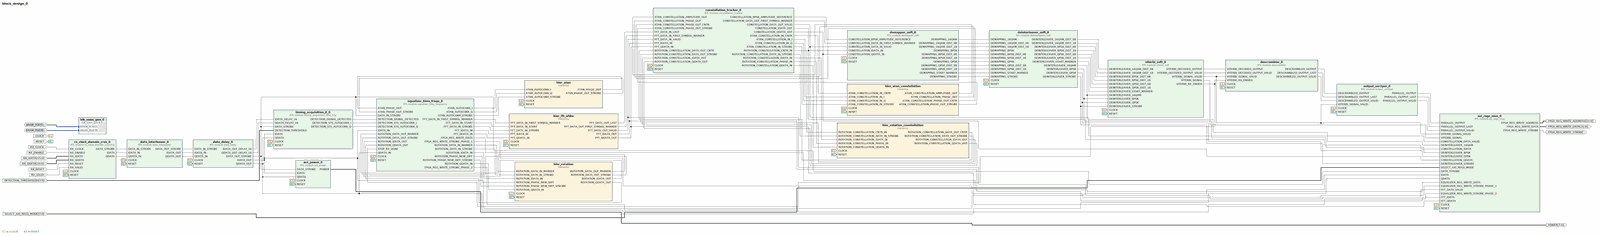
[diagram p0: block diagram of the top level, whole]
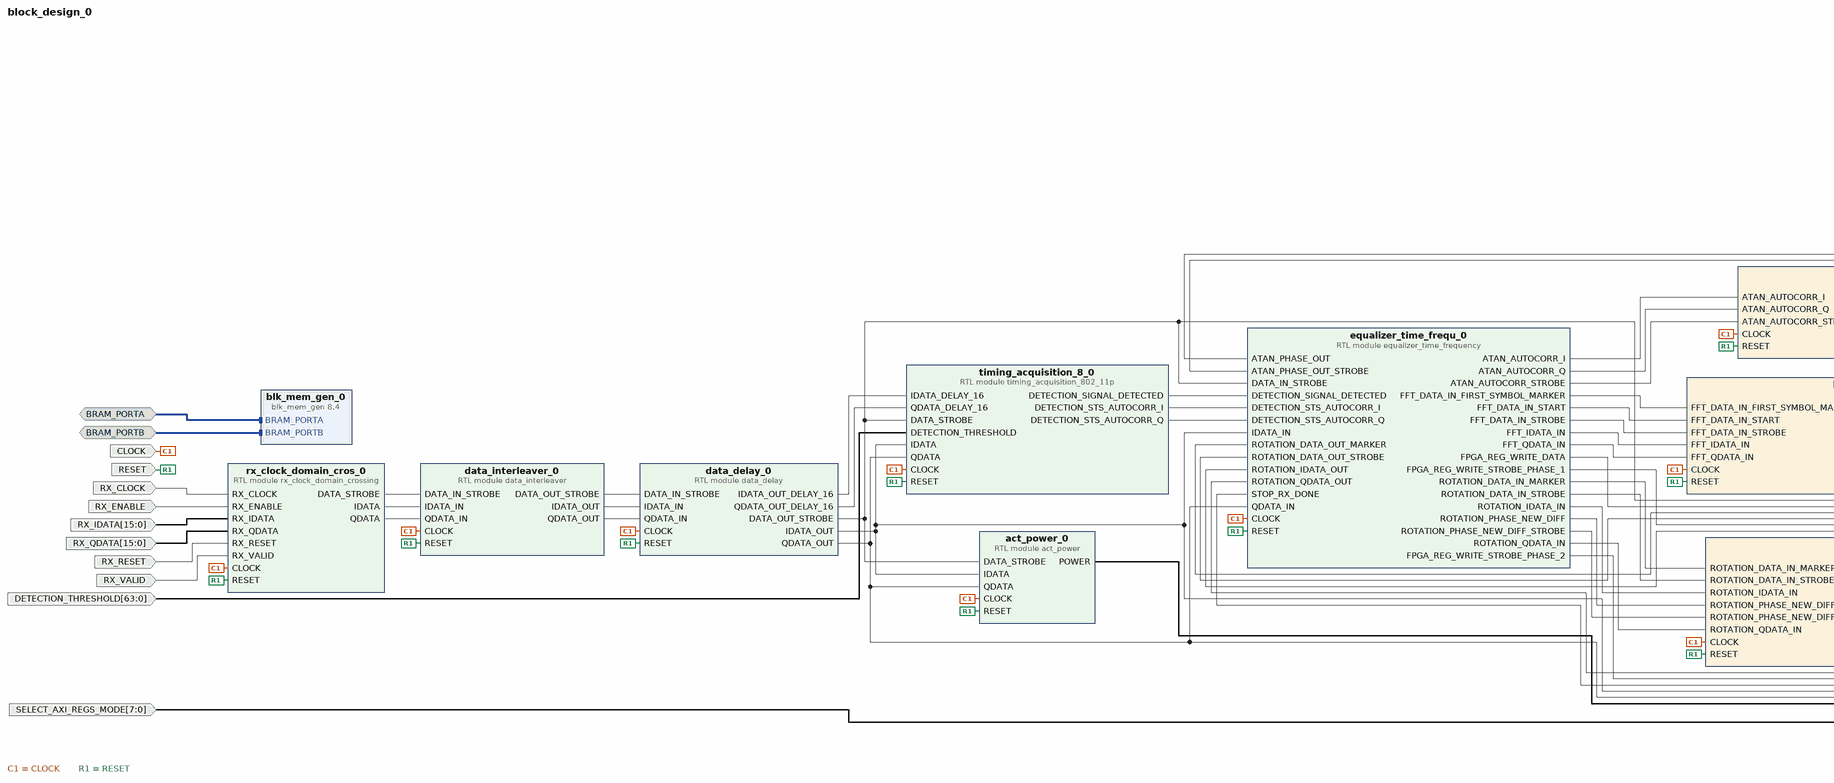
[diagram p1: block diagram of the top level, left part]
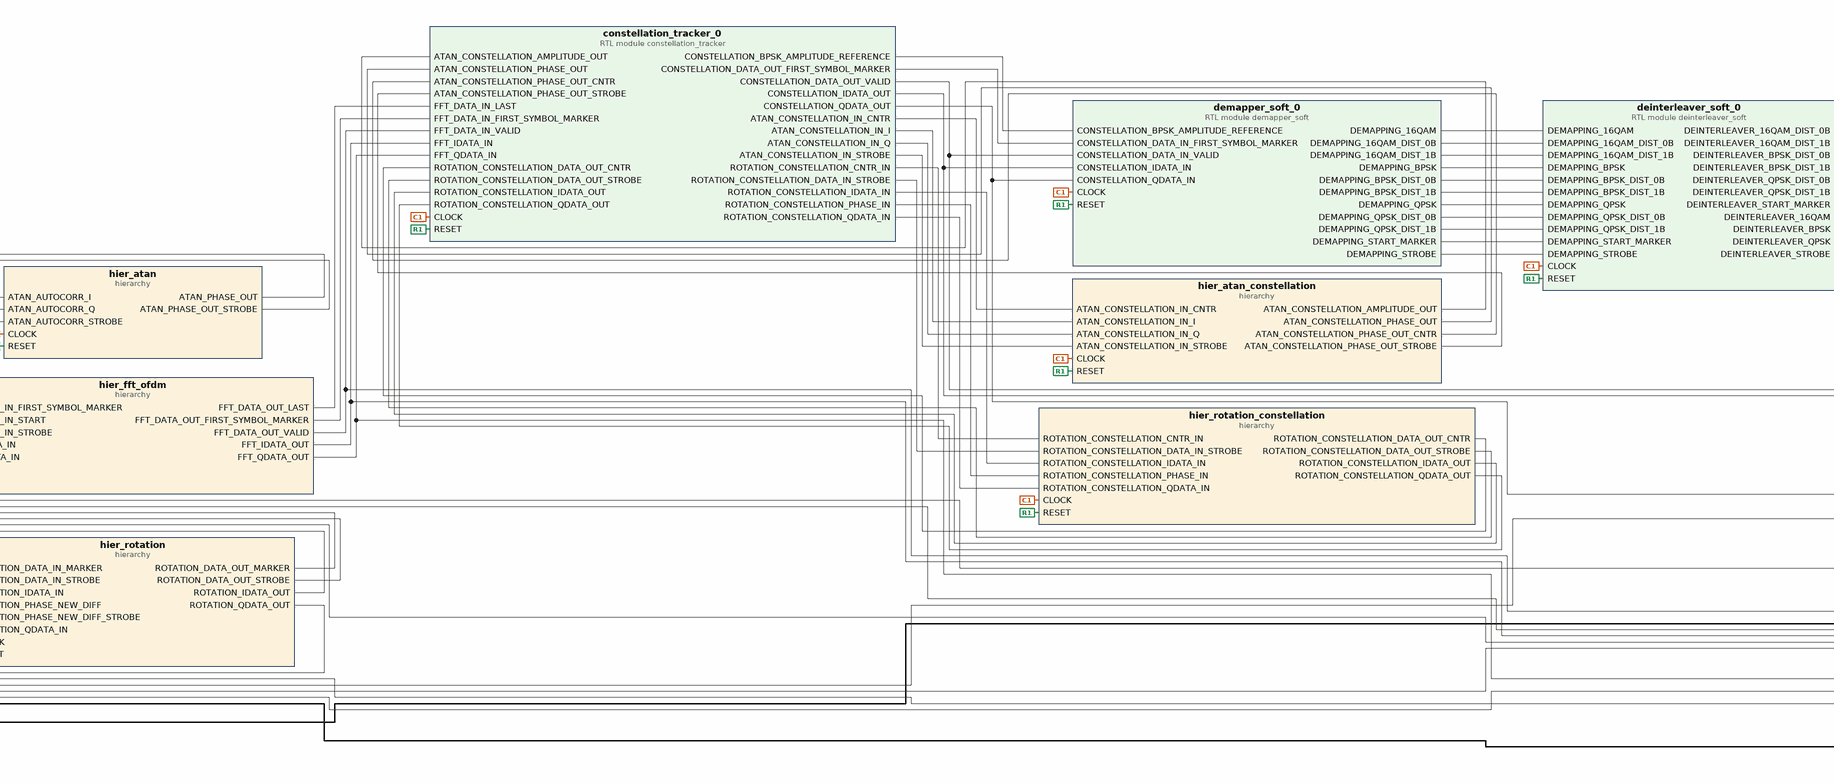
[diagram p2: block diagram of the top level, centre part]
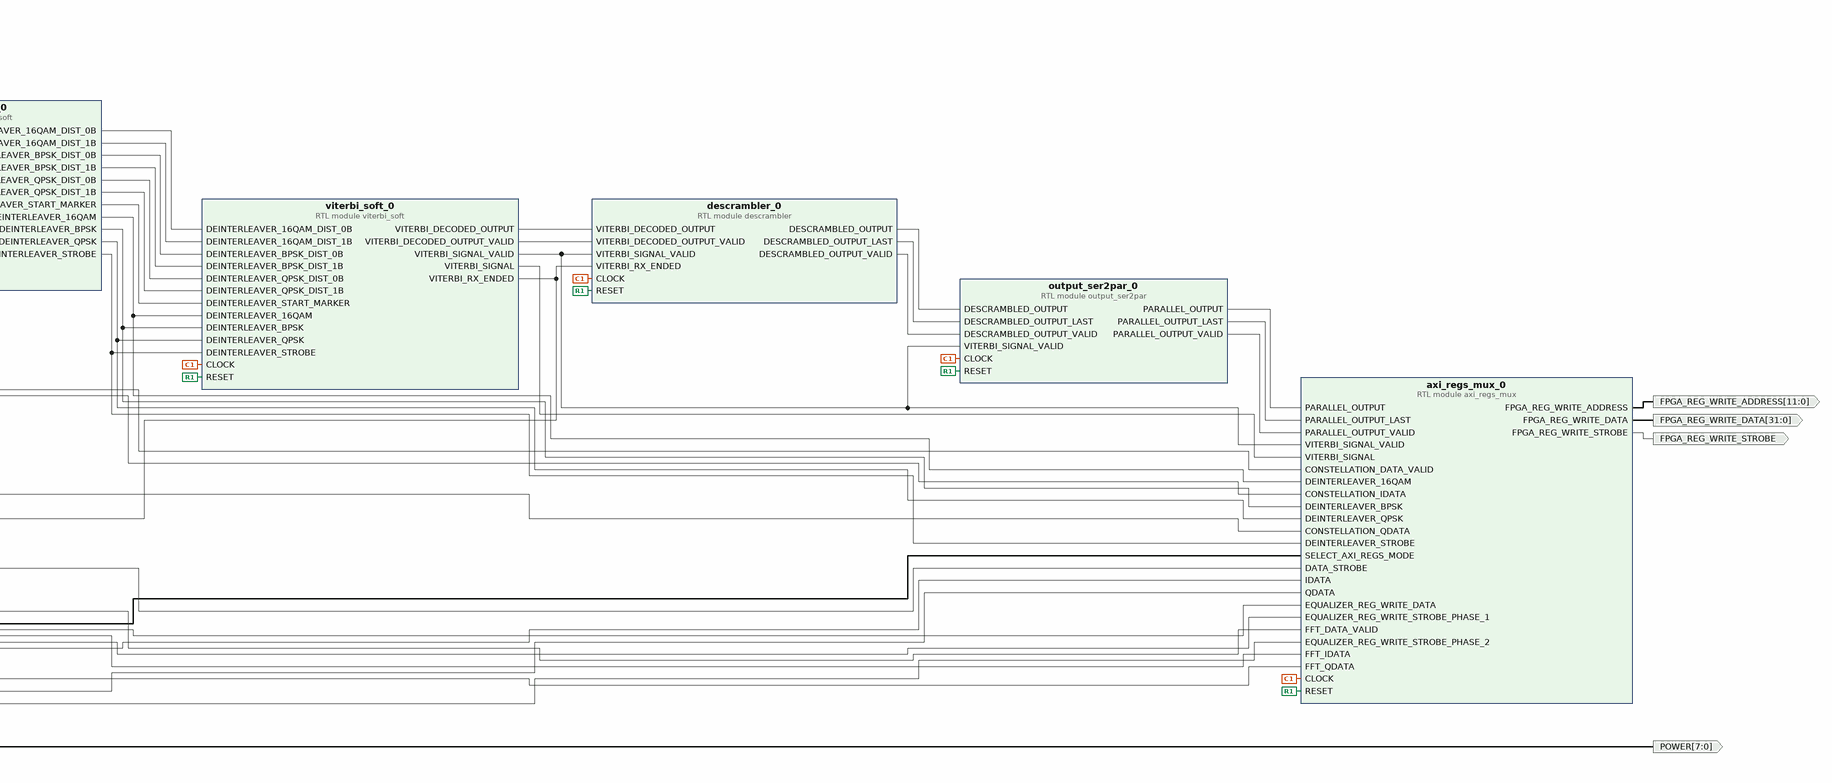
[diagram p3: block diagram of the top level, right part]
# Vivado block design block_design_0, xc7z020clg484-1, Vivado 2023.2.2
create_bd_design block_design_0

create_bd_intf_port -mode Slave -vlnv xilinx.com:interface:bram_rtl:1.0 BRAM_PORTA
create_bd_intf_port -mode Slave -vlnv xilinx.com:interface:bram_rtl:1.0 BRAM_PORTB
create_bd_port -dir I -type rst RESET
create_bd_port -dir I -type clk CLOCK
create_bd_port -dir I RX_VALID
create_bd_port -dir I RX_ENABLE
create_bd_port -dir I -type clk RX_CLOCK
set_property -dict {CONFIG.FREQ_HZ 10000000} [get_bd_ports RX_CLOCK]
create_bd_port -dir I -type rst RX_RESET
create_bd_port -dir I -from 15 -to 0 RX_IDATA
create_bd_port -dir I -from 15 -to 0 RX_QDATA
create_bd_port -dir O -from 7 -to 0 POWER
create_bd_port -dir I -from 63 -to 0 DETECTION_THRESHOLD
create_bd_port -dir O -from 11 -to 0 FPGA_REG_WRITE_ADDRESS
create_bd_port -dir O FPGA_REG_WRITE_STROBE
create_bd_port -dir O -from 31 -to 0 FPGA_REG_WRITE_DATA
create_bd_port -dir I -from 7 -to 0 SELECT_AXI_REGS_MODE

create_bd_cell -type module -reference rx_clock_domain_crossing rx_clock_domain_cros_0
create_bd_cell -type module -reference data_interleaver data_interleaver_0
create_bd_cell -type module -reference data_delay data_delay_0
create_bd_cell -type module -reference act_power act_power_0
create_bd_cell -type module -reference timing_acquisition_802_11p timing_acquisition_8_0
create_bd_cell -type hier hier_fft_ofdm
create_bd_cell -type hier hier_atan
create_bd_cell -type hier hier_rotation
create_bd_cell -type module -reference equalizer_time_frequency equalizer_time_frequ_0
create_bd_cell -type module -reference axi_regs_mux axi_regs_mux_0
create_bd_cell -type hier hier_atan_constellation
create_bd_cell -type hier hier_rotation_constellation
create_bd_cell -type module -reference constellation_tracker constellation_tracker_0
create_bd_cell -type module -reference descrambler descrambler_0
create_bd_cell -type module -reference output_ser2par output_ser2par_0
create_bd_cell -type ip -vlnv xilinx.com:ip:blk_mem_gen:8.4 blk_mem_gen_0
set_property -dict [list \
  CONFIG.Assume_Synchronous_Clk true \
  CONFIG.Collision_Warnings ALL \
  CONFIG.Disable_Collision_Warnings false \
  CONFIG.Fill_Remaining_Memory_Locations true \
  CONFIG.Memory_Type Simple_Dual_Port_RAM \
  CONFIG.Operating_Mode_A READ_FIRST \
  CONFIG.Register_PortB_Output_of_Memory_Primitives false \
  CONFIG.Use_RSTB_Pin false \
  CONFIG.Write_Depth_A 4096 \
  CONFIG.ecctype No_ECC \
  CONFIG.use_bram_block Stand_Alone \
] [get_bd_cells blk_mem_gen_0]
create_bd_cell -type module -reference demapper_soft demapper_soft_0
create_bd_cell -type module -reference deinterleaver_soft deinterleaver_soft_0
create_bd_cell -type module -reference viterbi_soft viterbi_soft_0

# ---- hierarchy /hier_fft_ofdm ----
current_bd_instance /hier_fft_ofdm
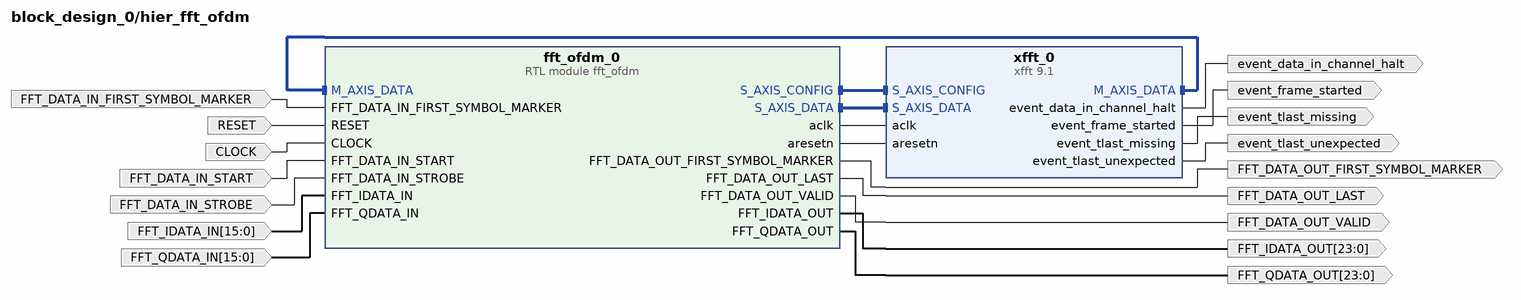
[diagram p4: block diagram inside /hier_fft_ofdm]
create_bd_pin -dir I -type rst RESET
create_bd_pin -dir I -type clk CLOCK
create_bd_pin -dir I -from 15 -to 0 FFT_IDATA_IN
create_bd_pin -dir I -from 15 -to 0 FFT_QDATA_IN
create_bd_pin -dir I FFT_DATA_IN_STROBE
create_bd_pin -dir I FFT_DATA_IN_START
create_bd_pin -dir O -from 23 -to 0 FFT_IDATA_OUT
create_bd_pin -dir O -from 23 -to 0 FFT_QDATA_OUT
create_bd_pin -dir O FFT_DATA_OUT_VALID
create_bd_pin -dir O FFT_DATA_OUT_LAST
create_bd_pin -dir O -type intr event_frame_started
create_bd_pin -dir O -type intr event_tlast_unexpected
create_bd_pin -dir O -type intr event_tlast_missing
create_bd_pin -dir O -type intr event_data_in_channel_halt
create_bd_pin -dir I FFT_DATA_IN_FIRST_SYMBOL_MARKER
create_bd_pin -dir O FFT_DATA_OUT_FIRST_SYMBOL_MARKER

create_bd_cell -type module -reference fft_ofdm fft_ofdm_0
create_bd_cell -type ip -vlnv xilinx.com:ip:xfft:9.1 xfft_0
set_property -dict [list \
  CONFIG.aresetn true \
  CONFIG.implementation_options automatically_select \
  CONFIG.number_of_stages_using_block_ram_for_data_and_phase_factors 0 \
  CONFIG.output_ordering natural_order \
  CONFIG.scaling_options unscaled \
  CONFIG.target_clock_frequency 100 \
  CONFIG.target_data_throughput 10 \
  CONFIG.throttle_scheme realtime \
  CONFIG.transform_length 64 \
] [get_bd_cells xfft_0]

# ---- hierarchy /hier_atan ----
current_bd_instance /hier_atan
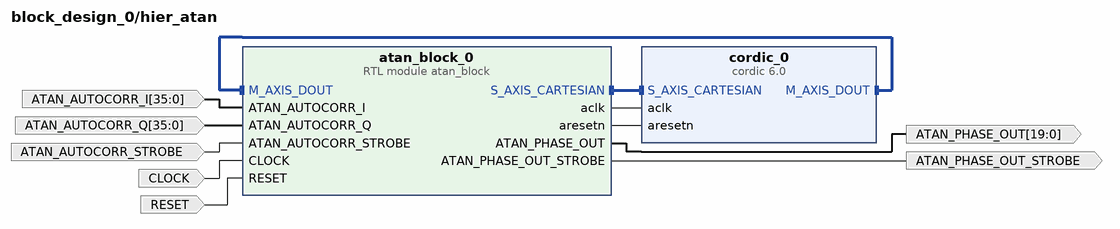
[diagram p5: block diagram inside /hier_atan]
create_bd_pin -dir I -type rst RESET
create_bd_pin -dir I -type clk CLOCK
create_bd_pin -dir I ATAN_AUTOCORR_STROBE
create_bd_pin -dir I -from 35 -to 0 ATAN_AUTOCORR_I
create_bd_pin -dir I -from 35 -to 0 ATAN_AUTOCORR_Q
create_bd_pin -dir O ATAN_PHASE_OUT_STROBE
create_bd_pin -dir O -from 19 -to 0 ATAN_PHASE_OUT

create_bd_cell -type ip -vlnv xilinx.com:ip:cordic:6.0 cordic_0
set_property -dict [list \
  CONFIG.ARESETN true \
  CONFIG.Architectural_Configuration Word_Serial \
  CONFIG.Data_Format SignedFraction \
  CONFIG.Functional_Selection Arc_Tan \
  CONFIG.Input_Width 36 \
  CONFIG.Output_Width 20 \
  CONFIG.Phase_Format Scaled_Radians \
  CONFIG.Pipelining_Mode Optimal \
] [get_bd_cells cordic_0]
create_bd_cell -type module -reference atan_block atan_block_0

# ---- hierarchy /hier_rotation ----
current_bd_instance /hier_rotation
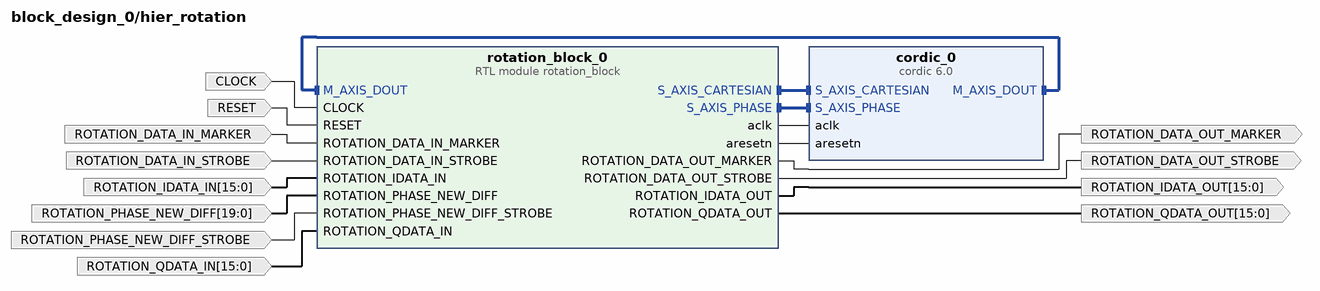
[diagram p6: block diagram inside /hier_rotation]
create_bd_pin -dir I -type rst RESET
create_bd_pin -dir I -type clk CLOCK
create_bd_pin -dir I ROTATION_DATA_IN_STROBE
create_bd_pin -dir I ROTATION_DATA_IN_MARKER
create_bd_pin -dir I -from 15 -to 0 ROTATION_IDATA_IN
create_bd_pin -dir I -from 15 -to 0 ROTATION_QDATA_IN
create_bd_pin -dir I ROTATION_PHASE_NEW_DIFF_STROBE
create_bd_pin -dir I -from 19 -to 0 ROTATION_PHASE_NEW_DIFF
create_bd_pin -dir O ROTATION_DATA_OUT_STROBE
create_bd_pin -dir O ROTATION_DATA_OUT_MARKER
create_bd_pin -dir O -from 15 -to 0 ROTATION_IDATA_OUT
create_bd_pin -dir O -from 15 -to 0 ROTATION_QDATA_OUT

create_bd_cell -type module -reference rotation_block rotation_block_0
create_bd_cell -type ip -vlnv xilinx.com:ip:cordic:6.0 cordic_0
set_property -dict [list \
  CONFIG.ARESETN true \
  CONFIG.Input_Width 16 \
  CONFIG.Output_Width 16 \
  CONFIG.Phase_Format Scaled_Radians \
  CONFIG.cartesian_has_tlast true \
  CONFIG.out_tlast_behv Pass_Cartesian_TLAST \
] [get_bd_cells cordic_0]

# ---- hierarchy /hier_atan_constellation ----
current_bd_instance /hier_atan_constellation
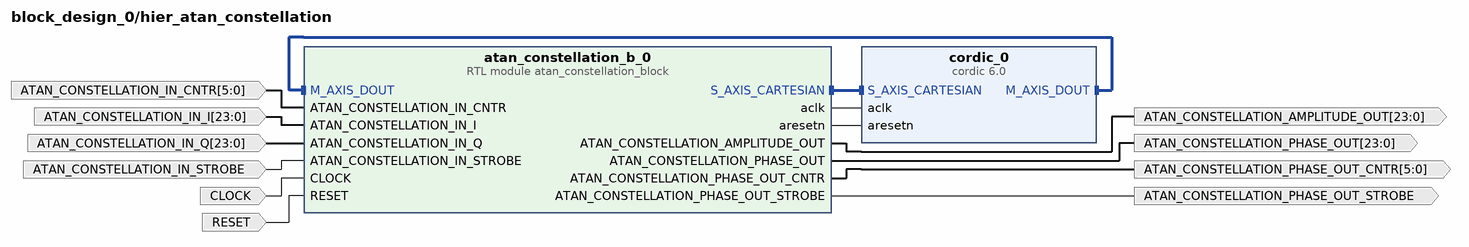
[diagram p7: block diagram inside /hier_atan_constellation]
create_bd_pin -dir I -type rst RESET
create_bd_pin -dir I -type clk CLOCK
create_bd_pin -dir I ATAN_CONSTELLATION_IN_STROBE
create_bd_pin -dir I -from 23 -to 0 ATAN_CONSTELLATION_IN_I
create_bd_pin -dir I -from 23 -to 0 ATAN_CONSTELLATION_IN_Q
create_bd_pin -dir I -from 5 -to 0 ATAN_CONSTELLATION_IN_CNTR
create_bd_pin -dir O ATAN_CONSTELLATION_PHASE_OUT_STROBE
create_bd_pin -dir O -from 23 -to 0 ATAN_CONSTELLATION_PHASE_OUT
create_bd_pin -dir O -from 5 -to 0 ATAN_CONSTELLATION_PHASE_OUT_CNTR
create_bd_pin -dir O -from 23 -to 0 ATAN_CONSTELLATION_AMPLITUDE_OUT

create_bd_cell -type module -reference atan_constellation_block atan_constellation_b_0
create_bd_cell -type ip -vlnv xilinx.com:ip:cordic:6.0 cordic_0
set_property -dict [list \
  CONFIG.ARESETN true \
  CONFIG.Architectural_Configuration Parallel \
  CONFIG.Compensation_Scaling No_Scale_Compensation \
  CONFIG.Data_Format SignedFraction \
  CONFIG.Functional_Selection Translate \
  CONFIG.Input_Width 24 \
  CONFIG.Output_Width 24 \
  CONFIG.Phase_Format Scaled_Radians \
  CONFIG.Pipelining_Mode Maximum \
  CONFIG.cartesian_has_tuser true \
  CONFIG.cartesian_tuser_width 6 \
] [get_bd_cells cordic_0]

# ---- hierarchy /hier_rotation_constellation ----
current_bd_instance /hier_rotation_constellation
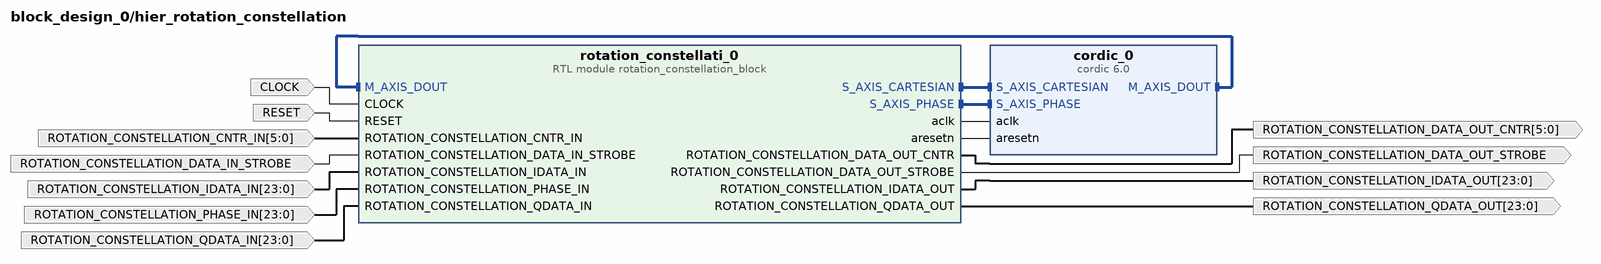
[diagram p8: block diagram inside /hier_rotation_constellation]
create_bd_pin -dir I -type rst RESET
create_bd_pin -dir I -type clk CLOCK
create_bd_pin -dir I ROTATION_CONSTELLATION_DATA_IN_STROBE
create_bd_pin -dir I -from 23 -to 0 ROTATION_CONSTELLATION_IDATA_IN
create_bd_pin -dir I -from 23 -to 0 ROTATION_CONSTELLATION_QDATA_IN
create_bd_pin -dir I -from 23 -to 0 ROTATION_CONSTELLATION_PHASE_IN
create_bd_pin -dir I -from 5 -to 0 ROTATION_CONSTELLATION_CNTR_IN
create_bd_pin -dir O ROTATION_CONSTELLATION_DATA_OUT_STROBE
create_bd_pin -dir O -from 23 -to 0 ROTATION_CONSTELLATION_IDATA_OUT
create_bd_pin -dir O -from 23 -to 0 ROTATION_CONSTELLATION_QDATA_OUT
create_bd_pin -dir O -from 5 -to 0 ROTATION_CONSTELLATION_DATA_OUT_CNTR

create_bd_cell -type ip -vlnv xilinx.com:ip:cordic:6.0 cordic_0
set_property -dict [list \
  CONFIG.ARESETN true \
  CONFIG.Input_Width 24 \
  CONFIG.Output_Width 24 \
  CONFIG.Phase_Format Scaled_Radians \
  CONFIG.cartesian_has_tlast false \
  CONFIG.cartesian_has_tuser true \
  CONFIG.cartesian_tuser_width 6 \
  CONFIG.out_tlast_behv Null \
] [get_bd_cells cordic_0]
create_bd_cell -type module -reference rotation_constellation_block rotation_constellati_0

# ---- connections ----

current_bd_instance /hier_fft_ofdm
connect_bd_intf_net [get_bd_intf_pins xfft_0/S_AXIS_CONFIG] [get_bd_intf_pins fft_ofdm_0/S_AXIS_CONFIG]
connect_bd_intf_net [get_bd_intf_pins fft_ofdm_0/S_AXIS_DATA] [get_bd_intf_pins xfft_0/S_AXIS_DATA]
connect_bd_intf_net [get_bd_intf_pins xfft_0/M_AXIS_DATA] [get_bd_intf_pins fft_ofdm_0/M_AXIS_DATA]
connect_bd_net [get_bd_pins FFT_DATA_IN_FIRST_SYMBOL_MARKER] [get_bd_pins fft_ofdm_0/FFT_DATA_IN_FIRST_SYMBOL_MARKER]
connect_bd_net [get_bd_pins RESET] [get_bd_pins fft_ofdm_0/RESET]
connect_bd_net [get_bd_pins CLOCK] [get_bd_pins fft_ofdm_0/CLOCK]
connect_bd_net [get_bd_pins fft_ofdm_0/FFT_DATA_OUT_FIRST_SYMBOL_MARKER] [get_bd_pins FFT_DATA_OUT_FIRST_SYMBOL_MARKER]
connect_bd_net [get_bd_pins fft_ofdm_0/FFT_DATA_OUT_LAST] [get_bd_pins FFT_DATA_OUT_LAST]
connect_bd_net [get_bd_pins fft_ofdm_0/FFT_DATA_OUT_VALID] [get_bd_pins FFT_DATA_OUT_VALID]
connect_bd_net [get_bd_pins fft_ofdm_0/FFT_IDATA_OUT] [get_bd_pins FFT_IDATA_OUT]
connect_bd_net [get_bd_pins fft_ofdm_0/FFT_QDATA_OUT] [get_bd_pins FFT_QDATA_OUT]
connect_bd_net [get_bd_pins fft_ofdm_0/aclk] [get_bd_pins xfft_0/aclk]
connect_bd_net [get_bd_pins fft_ofdm_0/aresetn] [get_bd_pins xfft_0/aresetn]
connect_bd_net -net receiver_802_11p_0_FFT_DATA_IN_START [get_bd_pins FFT_DATA_IN_START] [get_bd_pins fft_ofdm_0/FFT_DATA_IN_START]
connect_bd_net -net receiver_802_11p_0_FFT_DATA_IN_STROBE [get_bd_pins FFT_DATA_IN_STROBE] [get_bd_pins fft_ofdm_0/FFT_DATA_IN_STROBE]
connect_bd_net -net receiver_802_11p_0_FFT_IDATA_IN [get_bd_pins FFT_IDATA_IN] [get_bd_pins fft_ofdm_0/FFT_IDATA_IN]
connect_bd_net -net receiver_802_11p_0_FFT_QDATA_IN [get_bd_pins FFT_QDATA_IN] [get_bd_pins fft_ofdm_0/FFT_QDATA_IN]
connect_bd_net [get_bd_pins xfft_0/event_data_in_channel_halt] [get_bd_pins event_data_in_channel_halt]
connect_bd_net [get_bd_pins xfft_0/event_frame_started] [get_bd_pins event_frame_started]
connect_bd_net [get_bd_pins xfft_0/event_tlast_missing] [get_bd_pins event_tlast_missing]
connect_bd_net [get_bd_pins xfft_0/event_tlast_unexpected] [get_bd_pins event_tlast_unexpected]

current_bd_instance /hier_atan
connect_bd_intf_net [get_bd_intf_pins cordic_0/S_AXIS_CARTESIAN] [get_bd_intf_pins atan_block_0/S_AXIS_CARTESIAN]
connect_bd_intf_net [get_bd_intf_pins cordic_0/M_AXIS_DOUT] [get_bd_intf_pins atan_block_0/M_AXIS_DOUT]
connect_bd_net [get_bd_pins ATAN_AUTOCORR_I] [get_bd_pins atan_block_0/ATAN_AUTOCORR_I]
connect_bd_net [get_bd_pins ATAN_AUTOCORR_Q] [get_bd_pins atan_block_0/ATAN_AUTOCORR_Q]
connect_bd_net [get_bd_pins ATAN_AUTOCORR_STROBE] [get_bd_pins atan_block_0/ATAN_AUTOCORR_STROBE]
connect_bd_net [get_bd_pins CLOCK] [get_bd_pins atan_block_0/CLOCK]
connect_bd_net [get_bd_pins RESET] [get_bd_pins atan_block_0/RESET]
connect_bd_net [get_bd_pins atan_block_0/ATAN_PHASE_OUT] [get_bd_pins ATAN_PHASE_OUT]
connect_bd_net [get_bd_pins atan_block_0/ATAN_PHASE_OUT_STROBE] [get_bd_pins ATAN_PHASE_OUT_STROBE]
connect_bd_net [get_bd_pins atan_block_0/aclk] [get_bd_pins cordic_0/aclk]
connect_bd_net [get_bd_pins atan_block_0/aresetn] [get_bd_pins cordic_0/aresetn]

current_bd_instance /hier_rotation
connect_bd_intf_net [get_bd_intf_pins cordic_0/M_AXIS_DOUT] [get_bd_intf_pins rotation_block_0/M_AXIS_DOUT]
connect_bd_intf_net [get_bd_intf_pins cordic_0/S_AXIS_CARTESIAN] [get_bd_intf_pins rotation_block_0/S_AXIS_CARTESIAN]
connect_bd_intf_net [get_bd_intf_pins cordic_0/S_AXIS_PHASE] [get_bd_intf_pins rotation_block_0/S_AXIS_PHASE]
connect_bd_net -net CLOCK_0_1 [get_bd_pins CLOCK] [get_bd_pins rotation_block_0/CLOCK]
connect_bd_net -net RESET_0_1 [get_bd_pins RESET] [get_bd_pins rotation_block_0/RESET]
connect_bd_net -net receiver_802_11p_0_ROTATION_DATA_IN_MARKER [get_bd_pins ROTATION_DATA_IN_MARKER] \
  [get_bd_pins rotation_block_0/ROTATION_DATA_IN_MARKER]
connect_bd_net -net receiver_802_11p_0_ROTATION_DATA_IN_STROBE [get_bd_pins ROTATION_DATA_IN_STROBE] \
  [get_bd_pins rotation_block_0/ROTATION_DATA_IN_STROBE]
connect_bd_net -net receiver_802_11p_0_ROTATION_IDATA_IN [get_bd_pins ROTATION_IDATA_IN] [get_bd_pins rotation_block_0/ROTATION_IDATA_IN]
connect_bd_net -net receiver_802_11p_0_ROTATION_PHASE_NEW_DIFF [get_bd_pins ROTATION_PHASE_NEW_DIFF] \
  [get_bd_pins rotation_block_0/ROTATION_PHASE_NEW_DIFF]
connect_bd_net -net receiver_802_11p_0_ROTATION_PHASE_NEW_DIFF_STROBE [get_bd_pins ROTATION_PHASE_NEW_DIFF_STROBE] \
  [get_bd_pins rotation_block_0/ROTATION_PHASE_NEW_DIFF_STROBE]
connect_bd_net -net receiver_802_11p_0_ROTATION_QDATA_IN [get_bd_pins ROTATION_QDATA_IN] [get_bd_pins rotation_block_0/ROTATION_QDATA_IN]
connect_bd_net [get_bd_pins rotation_block_0/ROTATION_DATA_OUT_MARKER] [get_bd_pins ROTATION_DATA_OUT_MARKER]
connect_bd_net [get_bd_pins rotation_block_0/ROTATION_DATA_OUT_STROBE] [get_bd_pins ROTATION_DATA_OUT_STROBE]
connect_bd_net [get_bd_pins rotation_block_0/ROTATION_IDATA_OUT] [get_bd_pins ROTATION_IDATA_OUT]
connect_bd_net [get_bd_pins rotation_block_0/ROTATION_QDATA_OUT] [get_bd_pins ROTATION_QDATA_OUT]
connect_bd_net [get_bd_pins rotation_block_0/aclk] [get_bd_pins cordic_0/aclk]
connect_bd_net [get_bd_pins rotation_block_0/aresetn] [get_bd_pins cordic_0/aresetn]

current_bd_instance /hier_atan_constellation
connect_bd_intf_net [get_bd_intf_pins atan_constellation_b_0/S_AXIS_CARTESIAN] [get_bd_intf_pins cordic_0/S_AXIS_CARTESIAN]
connect_bd_intf_net [get_bd_intf_pins cordic_0/M_AXIS_DOUT] [get_bd_intf_pins atan_constellation_b_0/M_AXIS_DOUT]
connect_bd_net [get_bd_pins ATAN_CONSTELLATION_IN_CNTR] [get_bd_pins atan_constellation_b_0/ATAN_CONSTELLATION_IN_CNTR]
connect_bd_net [get_bd_pins ATAN_CONSTELLATION_IN_I] [get_bd_pins atan_constellation_b_0/ATAN_CONSTELLATION_IN_I]
connect_bd_net [get_bd_pins ATAN_CONSTELLATION_IN_Q] [get_bd_pins atan_constellation_b_0/ATAN_CONSTELLATION_IN_Q]
connect_bd_net [get_bd_pins ATAN_CONSTELLATION_IN_STROBE] [get_bd_pins atan_constellation_b_0/ATAN_CONSTELLATION_IN_STROBE]
connect_bd_net -net CLOCK_0_1 [get_bd_pins CLOCK] [get_bd_pins atan_constellation_b_0/CLOCK]
connect_bd_net -net RESET_0_1 [get_bd_pins RESET] [get_bd_pins atan_constellation_b_0/RESET]
connect_bd_net [get_bd_pins atan_constellation_b_0/ATAN_CONSTELLATION_AMPLITUDE_OUT] [get_bd_pins ATAN_CONSTELLATION_AMPLITUDE_OUT]
connect_bd_net [get_bd_pins atan_constellation_b_0/ATAN_CONSTELLATION_PHASE_OUT] [get_bd_pins ATAN_CONSTELLATION_PHASE_OUT]
connect_bd_net [get_bd_pins atan_constellation_b_0/ATAN_CONSTELLATION_PHASE_OUT_CNTR] [get_bd_pins ATAN_CONSTELLATION_PHASE_OUT_CNTR]
connect_bd_net [get_bd_pins atan_constellation_b_0/ATAN_CONSTELLATION_PHASE_OUT_STROBE] [get_bd_pins ATAN_CONSTELLATION_PHASE_OUT_STROBE]
connect_bd_net [get_bd_pins atan_constellation_b_0/aclk] [get_bd_pins cordic_0/aclk]
connect_bd_net [get_bd_pins atan_constellation_b_0/aresetn] [get_bd_pins cordic_0/aresetn]

current_bd_instance /hier_rotation_constellation
connect_bd_intf_net [get_bd_intf_pins rotation_constellati_0/M_AXIS_DOUT] [get_bd_intf_pins cordic_0/M_AXIS_DOUT]
connect_bd_intf_net [get_bd_intf_pins rotation_constellati_0/S_AXIS_CARTESIAN] [get_bd_intf_pins cordic_0/S_AXIS_CARTESIAN]
connect_bd_intf_net [get_bd_intf_pins cordic_0/S_AXIS_PHASE] [get_bd_intf_pins rotation_constellati_0/S_AXIS_PHASE]
connect_bd_net -net CLOCK_0_1 [get_bd_pins CLOCK] [get_bd_pins rotation_constellati_0/CLOCK]
connect_bd_net -net RESET_0_1 [get_bd_pins RESET] [get_bd_pins rotation_constellati_0/RESET]
connect_bd_net [get_bd_pins ROTATION_CONSTELLATION_CNTR_IN] [get_bd_pins rotation_constellati_0/ROTATION_CONSTELLATION_CNTR_IN]
connect_bd_net [get_bd_pins ROTATION_CONSTELLATION_DATA_IN_STROBE] [get_bd_pins rotation_constellati_0/ROTATION_CONSTELLATION_DATA_IN_STROBE]
connect_bd_net [get_bd_pins ROTATION_CONSTELLATION_IDATA_IN] [get_bd_pins rotation_constellati_0/ROTATION_CONSTELLATION_IDATA_IN]
connect_bd_net [get_bd_pins ROTATION_CONSTELLATION_PHASE_IN] [get_bd_pins rotation_constellati_0/ROTATION_CONSTELLATION_PHASE_IN]
connect_bd_net [get_bd_pins ROTATION_CONSTELLATION_QDATA_IN] [get_bd_pins rotation_constellati_0/ROTATION_CONSTELLATION_QDATA_IN]
connect_bd_net [get_bd_pins rotation_constellati_0/ROTATION_CONSTELLATION_DATA_OUT_CNTR] [get_bd_pins ROTATION_CONSTELLATION_DATA_OUT_CNTR]
connect_bd_net [get_bd_pins rotation_constellati_0/ROTATION_CONSTELLATION_DATA_OUT_STROBE] [get_bd_pins ROTATION_CONSTELLATION_DATA_OUT_STROBE]
connect_bd_net [get_bd_pins rotation_constellati_0/ROTATION_CONSTELLATION_IDATA_OUT] [get_bd_pins ROTATION_CONSTELLATION_IDATA_OUT]
connect_bd_net [get_bd_pins rotation_constellati_0/ROTATION_CONSTELLATION_QDATA_OUT] [get_bd_pins ROTATION_CONSTELLATION_QDATA_OUT]
connect_bd_net [get_bd_pins rotation_constellati_0/aclk] [get_bd_pins cordic_0/aclk]
connect_bd_net [get_bd_pins rotation_constellati_0/aresetn] [get_bd_pins cordic_0/aresetn]

current_bd_instance /
connect_bd_intf_net -intf_net BRAM_PORTA_0_1 [get_bd_intf_ports BRAM_PORTA] [get_bd_intf_pins blk_mem_gen_0/BRAM_PORTA]
connect_bd_intf_net -intf_net BRAM_PORTB_0_1 [get_bd_intf_ports BRAM_PORTB] [get_bd_intf_pins blk_mem_gen_0/BRAM_PORTB]
connect_bd_net -net CLOCK_0_1 [get_bd_ports CLOCK] \
  [get_bd_pins hier_fft_ofdm/CLOCK] [get_bd_pins hier_atan/CLOCK] [get_bd_pins hier_rotation/CLOCK] \
  [get_bd_pins hier_atan_constellation/CLOCK] [get_bd_pins hier_rotation_constellation/CLOCK] [get_bd_pins act_power_0/CLOCK] \
  [get_bd_pins data_interleaver_0/CLOCK] [get_bd_pins axi_regs_mux_0/CLOCK] [get_bd_pins output_ser2par_0/CLOCK] \
  [get_bd_pins rx_clock_domain_cros_0/CLOCK] [get_bd_pins deinterleaver_soft_0/CLOCK] [get_bd_pins demapper_soft_0/CLOCK] \
  [get_bd_pins constellation_tracker_0/CLOCK] [get_bd_pins data_delay_0/CLOCK] [get_bd_pins descrambler_0/CLOCK] \
  [get_bd_pins viterbi_soft_0/CLOCK] [get_bd_pins equalizer_time_frequ_0/CLOCK] [get_bd_pins timing_acquisition_8_0/CLOCK]
connect_bd_net -net DETECTION_THRESHOLD_0_1 [get_bd_ports DETECTION_THRESHOLD] [get_bd_pins timing_acquisition_8_0/DETECTION_THRESHOLD]
connect_bd_net -net RESET_0_1 [get_bd_ports RESET] \
  [get_bd_pins hier_fft_ofdm/RESET] [get_bd_pins hier_atan/RESET] [get_bd_pins hier_rotation/RESET] \
  [get_bd_pins hier_atan_constellation/RESET] [get_bd_pins hier_rotation_constellation/RESET] [get_bd_pins act_power_0/RESET] \
  [get_bd_pins data_interleaver_0/RESET] [get_bd_pins axi_regs_mux_0/RESET] [get_bd_pins output_ser2par_0/RESET] \
  [get_bd_pins rx_clock_domain_cros_0/RESET] [get_bd_pins deinterleaver_soft_0/RESET] [get_bd_pins demapper_soft_0/RESET] \
  [get_bd_pins constellation_tracker_0/RESET] [get_bd_pins data_delay_0/RESET] [get_bd_pins descrambler_0/RESET] \
  [get_bd_pins viterbi_soft_0/RESET] [get_bd_pins equalizer_time_frequ_0/RESET] [get_bd_pins timing_acquisition_8_0/RESET]
connect_bd_net -net RX_CLOCK_0_1 [get_bd_ports RX_CLOCK] [get_bd_pins rx_clock_domain_cros_0/RX_CLOCK]
connect_bd_net -net RX_ENABLE_0_1 [get_bd_ports RX_ENABLE] [get_bd_pins rx_clock_domain_cros_0/RX_ENABLE]
connect_bd_net -net RX_IDATA_0_1 [get_bd_ports RX_IDATA] [get_bd_pins rx_clock_domain_cros_0/RX_IDATA]
connect_bd_net -net RX_QDATA_0_1 [get_bd_ports RX_QDATA] [get_bd_pins rx_clock_domain_cros_0/RX_QDATA]
connect_bd_net -net RX_RESET_0_1 [get_bd_ports RX_RESET] [get_bd_pins rx_clock_domain_cros_0/RX_RESET]
connect_bd_net -net RX_VALID_0_1 [get_bd_ports RX_VALID] [get_bd_pins rx_clock_domain_cros_0/RX_VALID]
connect_bd_net -net SELECT_AXI_REGS_MODE_0_1 [get_bd_ports SELECT_AXI_REGS_MODE] [get_bd_pins axi_regs_mux_0/SELECT_AXI_REGS_MODE]
connect_bd_net [get_bd_pins act_power_0/POWER] [get_bd_ports POWER]
connect_bd_net [get_bd_pins axi_regs_mux_0/FPGA_REG_WRITE_DATA] [get_bd_ports FPGA_REG_WRITE_DATA]
connect_bd_net [get_bd_pins axi_regs_mux_0/FPGA_REG_WRITE_STROBE] [get_bd_ports FPGA_REG_WRITE_STROBE]
connect_bd_net [get_bd_pins constellation_tracker_0/ATAN_CONSTELLATION_IN_CNTR] [get_bd_pins hier_atan_constellation/ATAN_CONSTELLATION_IN_CNTR]
connect_bd_net [get_bd_pins constellation_tracker_0/ATAN_CONSTELLATION_IN_I] [get_bd_pins hier_atan_constellation/ATAN_CONSTELLATION_IN_I]
connect_bd_net [get_bd_pins constellation_tracker_0/ATAN_CONSTELLATION_IN_Q] [get_bd_pins hier_atan_constellation/ATAN_CONSTELLATION_IN_Q]
connect_bd_net [get_bd_pins constellation_tracker_0/ATAN_CONSTELLATION_IN_STROBE] [get_bd_pins hier_atan_constellation/ATAN_CONSTELLATION_IN_STROBE]
connect_bd_net [get_bd_pins constellation_tracker_0/CONSTELLATION_BPSK_AMPLITUDE_REFERENCE] \
  [get_bd_pins demapper_soft_0/CONSTELLATION_BPSK_AMPLITUDE_REFERENCE]
connect_bd_net [get_bd_pins constellation_tracker_0/CONSTELLATION_DATA_OUT_FIRST_SYMBOL_MARKER] \
  [get_bd_pins demapper_soft_0/CONSTELLATION_DATA_IN_FIRST_SYMBOL_MARKER]
connect_bd_net [get_bd_pins constellation_tracker_0/CONSTELLATION_DATA_OUT_VALID] \
  [get_bd_pins axi_regs_mux_0/CONSTELLATION_DATA_VALID] [get_bd_pins demapper_soft_0/CONSTELLATION_DATA_IN_VALID]
connect_bd_net [get_bd_pins constellation_tracker_0/CONSTELLATION_IDATA_OUT] \
  [get_bd_pins axi_regs_mux_0/CONSTELLATION_IDATA] [get_bd_pins demapper_soft_0/CONSTELLATION_IDATA_IN]
connect_bd_net [get_bd_pins constellation_tracker_0/CONSTELLATION_QDATA_OUT] \
  [get_bd_pins axi_regs_mux_0/CONSTELLATION_QDATA] [get_bd_pins demapper_soft_0/CONSTELLATION_QDATA_IN]
connect_bd_net [get_bd_pins constellation_tracker_0/ROTATION_CONSTELLATION_CNTR_IN] \
  [get_bd_pins hier_rotation_constellation/ROTATION_CONSTELLATION_CNTR_IN]
connect_bd_net [get_bd_pins constellation_tracker_0/ROTATION_CONSTELLATION_DATA_IN_STROBE] \
  [get_bd_pins hier_rotation_constellation/ROTATION_CONSTELLATION_DATA_IN_STROBE]
connect_bd_net [get_bd_pins constellation_tracker_0/ROTATION_CONSTELLATION_IDATA_IN] \
  [get_bd_pins hier_rotation_constellation/ROTATION_CONSTELLATION_IDATA_IN]
connect_bd_net [get_bd_pins constellation_tracker_0/ROTATION_CONSTELLATION_PHASE_IN] \
  [get_bd_pins hier_rotation_constellation/ROTATION_CONSTELLATION_PHASE_IN]
connect_bd_net [get_bd_pins constellation_tracker_0/ROTATION_CONSTELLATION_QDATA_IN] \
  [get_bd_pins hier_rotation_constellation/ROTATION_CONSTELLATION_QDATA_IN]
connect_bd_net [get_bd_pins data_delay_0/DATA_OUT_STROBE] \
  [get_bd_pins act_power_0/DATA_STROBE] [get_bd_pins axi_regs_mux_0/DATA_STROBE] \
  [get_bd_pins equalizer_time_frequ_0/DATA_IN_STROBE] [get_bd_pins timing_acquisition_8_0/DATA_STROBE]
connect_bd_net [get_bd_pins data_delay_0/IDATA_OUT] \
  [get_bd_pins act_power_0/IDATA] [get_bd_pins axi_regs_mux_0/IDATA] [get_bd_pins equalizer_time_frequ_0/IDATA_IN] \
  [get_bd_pins timing_acquisition_8_0/IDATA]
connect_bd_net [get_bd_pins data_delay_0/IDATA_OUT_DELAY_16] [get_bd_pins timing_acquisition_8_0/IDATA_DELAY_16]
connect_bd_net [get_bd_pins data_delay_0/QDATA_OUT] \
  [get_bd_pins act_power_0/QDATA] [get_bd_pins axi_regs_mux_0/QDATA] [get_bd_pins equalizer_time_frequ_0/QDATA_IN] \
  [get_bd_pins timing_acquisition_8_0/QDATA]
connect_bd_net [get_bd_pins data_delay_0/QDATA_OUT_DELAY_16] [get_bd_pins timing_acquisition_8_0/QDATA_DELAY_16]
connect_bd_net [get_bd_pins data_interleaver_0/DATA_OUT_STROBE] [get_bd_pins data_delay_0/DATA_IN_STROBE]
connect_bd_net [get_bd_pins data_interleaver_0/IDATA_OUT] [get_bd_pins data_delay_0/IDATA_IN]
connect_bd_net [get_bd_pins data_interleaver_0/QDATA_OUT] [get_bd_pins data_delay_0/QDATA_IN]
connect_bd_net [get_bd_pins deinterleaver_soft_0/DEINTERLEAVER_16QAM] \
  [get_bd_pins axi_regs_mux_0/DEINTERLEAVER_16QAM] [get_bd_pins viterbi_soft_0/DEINTERLEAVER_16QAM]
connect_bd_net [get_bd_pins deinterleaver_soft_0/DEINTERLEAVER_16QAM_DIST_0B] [get_bd_pins viterbi_soft_0/DEINTERLEAVER_16QAM_DIST_0B]
connect_bd_net [get_bd_pins deinterleaver_soft_0/DEINTERLEAVER_16QAM_DIST_1B] [get_bd_pins viterbi_soft_0/DEINTERLEAVER_16QAM_DIST_1B]
connect_bd_net [get_bd_pins deinterleaver_soft_0/DEINTERLEAVER_BPSK] \
  [get_bd_pins axi_regs_mux_0/DEINTERLEAVER_BPSK] [get_bd_pins viterbi_soft_0/DEINTERLEAVER_BPSK]
connect_bd_net [get_bd_pins deinterleaver_soft_0/DEINTERLEAVER_BPSK_DIST_0B] [get_bd_pins viterbi_soft_0/DEINTERLEAVER_BPSK_DIST_0B]
connect_bd_net [get_bd_pins deinterleaver_soft_0/DEINTERLEAVER_BPSK_DIST_1B] [get_bd_pins viterbi_soft_0/DEINTERLEAVER_BPSK_DIST_1B]
connect_bd_net [get_bd_pins deinterleaver_soft_0/DEINTERLEAVER_QPSK] \
  [get_bd_pins axi_regs_mux_0/DEINTERLEAVER_QPSK] [get_bd_pins viterbi_soft_0/DEINTERLEAVER_QPSK]
connect_bd_net [get_bd_pins deinterleaver_soft_0/DEINTERLEAVER_QPSK_DIST_0B] [get_bd_pins viterbi_soft_0/DEINTERLEAVER_QPSK_DIST_0B]
connect_bd_net [get_bd_pins deinterleaver_soft_0/DEINTERLEAVER_QPSK_DIST_1B] [get_bd_pins viterbi_soft_0/DEINTERLEAVER_QPSK_DIST_1B]
connect_bd_net [get_bd_pins deinterleaver_soft_0/DEINTERLEAVER_START_MARKER] [get_bd_pins viterbi_soft_0/DEINTERLEAVER_START_MARKER]
connect_bd_net [get_bd_pins deinterleaver_soft_0/DEINTERLEAVER_STROBE] \
  [get_bd_pins axi_regs_mux_0/DEINTERLEAVER_STROBE] [get_bd_pins viterbi_soft_0/DEINTERLEAVER_STROBE]
connect_bd_net [get_bd_pins demapper_soft_0/DEMAPPING_16QAM] [get_bd_pins deinterleaver_soft_0/DEMAPPING_16QAM]
connect_bd_net [get_bd_pins demapper_soft_0/DEMAPPING_16QAM_DIST_0B] [get_bd_pins deinterleaver_soft_0/DEMAPPING_16QAM_DIST_0B]
connect_bd_net [get_bd_pins demapper_soft_0/DEMAPPING_16QAM_DIST_1B] [get_bd_pins deinterleaver_soft_0/DEMAPPING_16QAM_DIST_1B]
connect_bd_net [get_bd_pins demapper_soft_0/DEMAPPING_BPSK] [get_bd_pins deinterleaver_soft_0/DEMAPPING_BPSK]
connect_bd_net [get_bd_pins demapper_soft_0/DEMAPPING_BPSK_DIST_0B] [get_bd_pins deinterleaver_soft_0/DEMAPPING_BPSK_DIST_0B]
connect_bd_net [get_bd_pins demapper_soft_0/DEMAPPING_BPSK_DIST_1B] [get_bd_pins deinterleaver_soft_0/DEMAPPING_BPSK_DIST_1B]
connect_bd_net [get_bd_pins demapper_soft_0/DEMAPPING_QPSK] [get_bd_pins deinterleaver_soft_0/DEMAPPING_QPSK]
connect_bd_net [get_bd_pins demapper_soft_0/DEMAPPING_QPSK_DIST_0B] [get_bd_pins deinterleaver_soft_0/DEMAPPING_QPSK_DIST_0B]
connect_bd_net [get_bd_pins demapper_soft_0/DEMAPPING_QPSK_DIST_1B] [get_bd_pins deinterleaver_soft_0/DEMAPPING_QPSK_DIST_1B]
connect_bd_net [get_bd_pins demapper_soft_0/DEMAPPING_START_MARKER] [get_bd_pins deinterleaver_soft_0/DEMAPPING_START_MARKER]
connect_bd_net [get_bd_pins demapper_soft_0/DEMAPPING_STROBE] [get_bd_pins deinterleaver_soft_0/DEMAPPING_STROBE]
connect_bd_net [get_bd_pins descrambler_0/DESCRAMBLED_OUTPUT] [get_bd_pins output_ser2par_0/DESCRAMBLED_OUTPUT]
connect_bd_net [get_bd_pins descrambler_0/DESCRAMBLED_OUTPUT_LAST] [get_bd_pins output_ser2par_0/DESCRAMBLED_OUTPUT_LAST]
connect_bd_net [get_bd_pins descrambler_0/DESCRAMBLED_OUTPUT_VALID] [get_bd_pins output_ser2par_0/DESCRAMBLED_OUTPUT_VALID]
connect_bd_net [get_bd_pins equalizer_time_frequ_0/FFT_DATA_IN_FIRST_SYMBOL_MARKER] [get_bd_pins hier_fft_ofdm/FFT_DATA_IN_FIRST_SYMBOL_MARKER]
connect_bd_net [get_bd_pins equalizer_time_frequ_0/FPGA_REG_WRITE_DATA] [get_bd_pins axi_regs_mux_0/EQUALIZER_REG_WRITE_DATA]
connect_bd_net [get_bd_pins equalizer_time_frequ_0/FPGA_REG_WRITE_STROBE_PHASE_1] [get_bd_pins axi_regs_mux_0/EQUALIZER_REG_WRITE_STROBE_PHASE_1]
connect_bd_net [get_bd_pins equalizer_time_frequ_0/FPGA_REG_WRITE_STROBE_PHASE_2] [get_bd_pins axi_regs_mux_0/EQUALIZER_REG_WRITE_STROBE_PHASE_2]
connect_bd_net [get_bd_pins equalizer_time_frequ_0/ROTATION_DATA_IN_MARKER] [get_bd_pins hier_rotation/ROTATION_DATA_IN_MARKER]
connect_bd_net [get_bd_pins equalizer_time_frequ_0/ROTATION_DATA_IN_STROBE] [get_bd_pins hier_rotation/ROTATION_DATA_IN_STROBE]
connect_bd_net [get_bd_pins equalizer_time_frequ_0/ROTATION_IDATA_IN] [get_bd_pins hier_rotation/ROTATION_IDATA_IN]
connect_bd_net [get_bd_pins equalizer_time_frequ_0/ROTATION_PHASE_NEW_DIFF] [get_bd_pins hier_rotation/ROTATION_PHASE_NEW_DIFF]
connect_bd_net [get_bd_pins equalizer_time_frequ_0/ROTATION_PHASE_NEW_DIFF_STROBE] [get_bd_pins hier_rotation/ROTATION_PHASE_NEW_DIFF_STROBE]
connect_bd_net [get_bd_pins equalizer_time_frequ_0/ROTATION_QDATA_IN] [get_bd_pins hier_rotation/ROTATION_QDATA_IN]
connect_bd_net -net fft_ofdm_0_FFT_DATA_OUT_LAST [get_bd_pins hier_fft_ofdm/FFT_DATA_OUT_LAST] [get_bd_pins constellation_tracker_0/FFT_DATA_IN_LAST]
connect_bd_net -net fft_ofdm_0_FFT_DATA_OUT_VALID [get_bd_pins hier_fft_ofdm/FFT_DATA_OUT_VALID] \
  [get_bd_pins axi_regs_mux_0/FFT_DATA_VALID] [get_bd_pins constellation_tracker_0/FFT_DATA_IN_VALID]
connect_bd_net -net fft_ofdm_0_FFT_IDATA_OUT [get_bd_pins hier_fft_ofdm/FFT_IDATA_OUT] \
  [get_bd_pins axi_regs_mux_0/FFT_IDATA] [get_bd_pins constellation_tracker_0/FFT_IDATA_IN]
connect_bd_net -net fft_ofdm_0_FFT_QDATA_OUT [get_bd_pins hier_fft_ofdm/FFT_QDATA_OUT] \
  [get_bd_pins axi_regs_mux_0/FFT_QDATA] [get_bd_pins constellation_tracker_0/FFT_QDATA_IN]
connect_bd_net [get_bd_pins hier_atan/ATAN_PHASE_OUT] [get_bd_pins equalizer_time_frequ_0/ATAN_PHASE_OUT]
connect_bd_net [get_bd_pins hier_atan/ATAN_PHASE_OUT_STROBE] [get_bd_pins equalizer_time_frequ_0/ATAN_PHASE_OUT_STROBE]
connect_bd_net [get_bd_pins hier_atan_constellation/ATAN_CONSTELLATION_AMPLITUDE_OUT] \
  [get_bd_pins constellation_tracker_0/ATAN_CONSTELLATION_AMPLITUDE_OUT]
connect_bd_net [get_bd_pins hier_atan_constellation/ATAN_CONSTELLATION_PHASE_OUT] [get_bd_pins constellation_tracker_0/ATAN_CONSTELLATION_PHASE_OUT]
connect_bd_net [get_bd_pins hier_atan_constellation/ATAN_CONSTELLATION_PHASE_OUT_CNTR] \
  [get_bd_pins constellation_tracker_0/ATAN_CONSTELLATION_PHASE_OUT_CNTR]
connect_bd_net [get_bd_pins hier_atan_constellation/ATAN_CONSTELLATION_PHASE_OUT_STROBE] \
  [get_bd_pins constellation_tracker_0/ATAN_CONSTELLATION_PHASE_OUT_STROBE]
connect_bd_net [get_bd_pins hier_fft_ofdm/FFT_DATA_OUT_FIRST_SYMBOL_MARKER] [get_bd_pins constellation_tracker_0/FFT_DATA_IN_FIRST_SYMBOL_MARKER]
connect_bd_net [get_bd_pins hier_rotation_constellation/ROTATION_CONSTELLATION_DATA_OUT_CNTR] \
  [get_bd_pins constellation_tracker_0/ROTATION_CONSTELLATION_DATA_OUT_CNTR]
connect_bd_net [get_bd_pins hier_rotation_constellation/ROTATION_CONSTELLATION_DATA_OUT_STROBE] \
  [get_bd_pins constellation_tracker_0/ROTATION_CONSTELLATION_DATA_OUT_STROBE]
connect_bd_net [get_bd_pins hier_rotation_constellation/ROTATION_CONSTELLATION_IDATA_OUT] \
  [get_bd_pins constellation_tracker_0/ROTATION_CONSTELLATION_IDATA_OUT]
connect_bd_net [get_bd_pins hier_rotation_constellation/ROTATION_CONSTELLATION_QDATA_OUT] \
  [get_bd_pins constellation_tracker_0/ROTATION_CONSTELLATION_QDATA_OUT]
connect_bd_net [get_bd_pins output_ser2par_0/PARALLEL_OUTPUT] [get_bd_pins axi_regs_mux_0/PARALLEL_OUTPUT]
connect_bd_net [get_bd_pins output_ser2par_0/PARALLEL_OUTPUT_LAST] [get_bd_pins axi_regs_mux_0/PARALLEL_OUTPUT_LAST]
connect_bd_net [get_bd_pins output_ser2par_0/PARALLEL_OUTPUT_VALID] [get_bd_pins axi_regs_mux_0/PARALLEL_OUTPUT_VALID]
connect_bd_net -net receiver_802_11p_0_ATAN_AUTOCORR_I [get_bd_pins equalizer_time_frequ_0/ATAN_AUTOCORR_I] [get_bd_pins hier_atan/ATAN_AUTOCORR_I]
connect_bd_net -net receiver_802_11p_0_ATAN_AUTOCORR_Q [get_bd_pins equalizer_time_frequ_0/ATAN_AUTOCORR_Q] [get_bd_pins hier_atan/ATAN_AUTOCORR_Q]
connect_bd_net -net receiver_802_11p_0_ATAN_AUTOCORR_STROBE [get_bd_pins equalizer_time_frequ_0/ATAN_AUTOCORR_STROBE] \
  [get_bd_pins hier_atan/ATAN_AUTOCORR_STROBE]
connect_bd_net -net receiver_802_11p_0_FFT_DATA_IN_START [get_bd_pins equalizer_time_frequ_0/FFT_DATA_IN_START] \
  [get_bd_pins hier_fft_ofdm/FFT_DATA_IN_START]
connect_bd_net -net receiver_802_11p_0_FFT_DATA_IN_STROBE [get_bd_pins equalizer_time_frequ_0/FFT_DATA_IN_STROBE] \
  [get_bd_pins hier_fft_ofdm/FFT_DATA_IN_STROBE]
connect_bd_net -net receiver_802_11p_0_FFT_IDATA_IN [get_bd_pins equalizer_time_frequ_0/FFT_IDATA_IN] [get_bd_pins hier_fft_ofdm/FFT_IDATA_IN]
connect_bd_net -net receiver_802_11p_0_FFT_QDATA_IN [get_bd_pins equalizer_time_frequ_0/FFT_QDATA_IN] [get_bd_pins hier_fft_ofdm/FFT_QDATA_IN]
connect_bd_net -net receiver_802_11p_0_FPGA_REG_WRITE_ADDRESS [get_bd_pins axi_regs_mux_0/FPGA_REG_WRITE_ADDRESS] \
  [get_bd_ports FPGA_REG_WRITE_ADDRESS]
connect_bd_net -net rotation_block_0_ROTATION_DATA_OUT_MARKER [get_bd_pins hier_rotation/ROTATION_DATA_OUT_MARKER] \
  [get_bd_pins equalizer_time_frequ_0/ROTATION_DATA_OUT_MARKER]
connect_bd_net -net rotation_block_0_ROTATION_DATA_OUT_STROBE [get_bd_pins hier_rotation/ROTATION_DATA_OUT_STROBE] \
  [get_bd_pins equalizer_time_frequ_0/ROTATION_DATA_OUT_STROBE]
connect_bd_net -net rotation_block_0_ROTATION_IDATA_OUT [get_bd_pins hier_rotation/ROTATION_IDATA_OUT] \
  [get_bd_pins equalizer_time_frequ_0/ROTATION_IDATA_OUT]
connect_bd_net -net rotation_block_0_ROTATION_QDATA_OUT [get_bd_pins hier_rotation/ROTATION_QDATA_OUT] \
  [get_bd_pins equalizer_time_frequ_0/ROTATION_QDATA_OUT]
connect_bd_net [get_bd_pins rx_clock_domain_cros_0/DATA_STROBE] [get_bd_pins data_interleaver_0/DATA_IN_STROBE]
connect_bd_net [get_bd_pins rx_clock_domain_cros_0/IDATA] [get_bd_pins data_interleaver_0/IDATA_IN]
connect_bd_net [get_bd_pins rx_clock_domain_cros_0/QDATA] [get_bd_pins data_interleaver_0/QDATA_IN]
connect_bd_net [get_bd_pins timing_acquisition_8_0/DETECTION_SIGNAL_DETECTED] [get_bd_pins equalizer_time_frequ_0/DETECTION_SIGNAL_DETECTED]
connect_bd_net [get_bd_pins timing_acquisition_8_0/DETECTION_STS_AUTOCORR_I] [get_bd_pins equalizer_time_frequ_0/DETECTION_STS_AUTOCORR_I]
connect_bd_net [get_bd_pins timing_acquisition_8_0/DETECTION_STS_AUTOCORR_Q] [get_bd_pins equalizer_time_frequ_0/DETECTION_STS_AUTOCORR_Q]
connect_bd_net -net viterbi_hard_0_VITERBI_RX_ENDED [get_bd_pins viterbi_soft_0/VITERBI_RX_ENDED] \
  [get_bd_pins descrambler_0/VITERBI_RX_ENDED] [get_bd_pins equalizer_time_frequ_0/STOP_RX_DONE]
connect_bd_net -net viterbi_hard_0_VITERBI_SIGNAL_VALID [get_bd_pins viterbi_soft_0/VITERBI_SIGNAL_VALID] \
  [get_bd_pins axi_regs_mux_0/VITERBI_SIGNAL_VALID] [get_bd_pins output_ser2par_0/VITERBI_SIGNAL_VALID] \
  [get_bd_pins descrambler_0/VITERBI_SIGNAL_VALID]
connect_bd_net [get_bd_pins viterbi_soft_0/VITERBI_DECODED_OUTPUT] [get_bd_pins descrambler_0/VITERBI_DECODED_OUTPUT]
connect_bd_net [get_bd_pins viterbi_soft_0/VITERBI_DECODED_OUTPUT_VALID] [get_bd_pins descrambler_0/VITERBI_DECODED_OUTPUT_VALID]
connect_bd_net [get_bd_pins viterbi_soft_0/VITERBI_SIGNAL] [get_bd_pins axi_regs_mux_0/VITERBI_SIGNAL]

validate_bd_design
save_bd_design
